# Altium project BMSSlaveBoard.PrjPcb
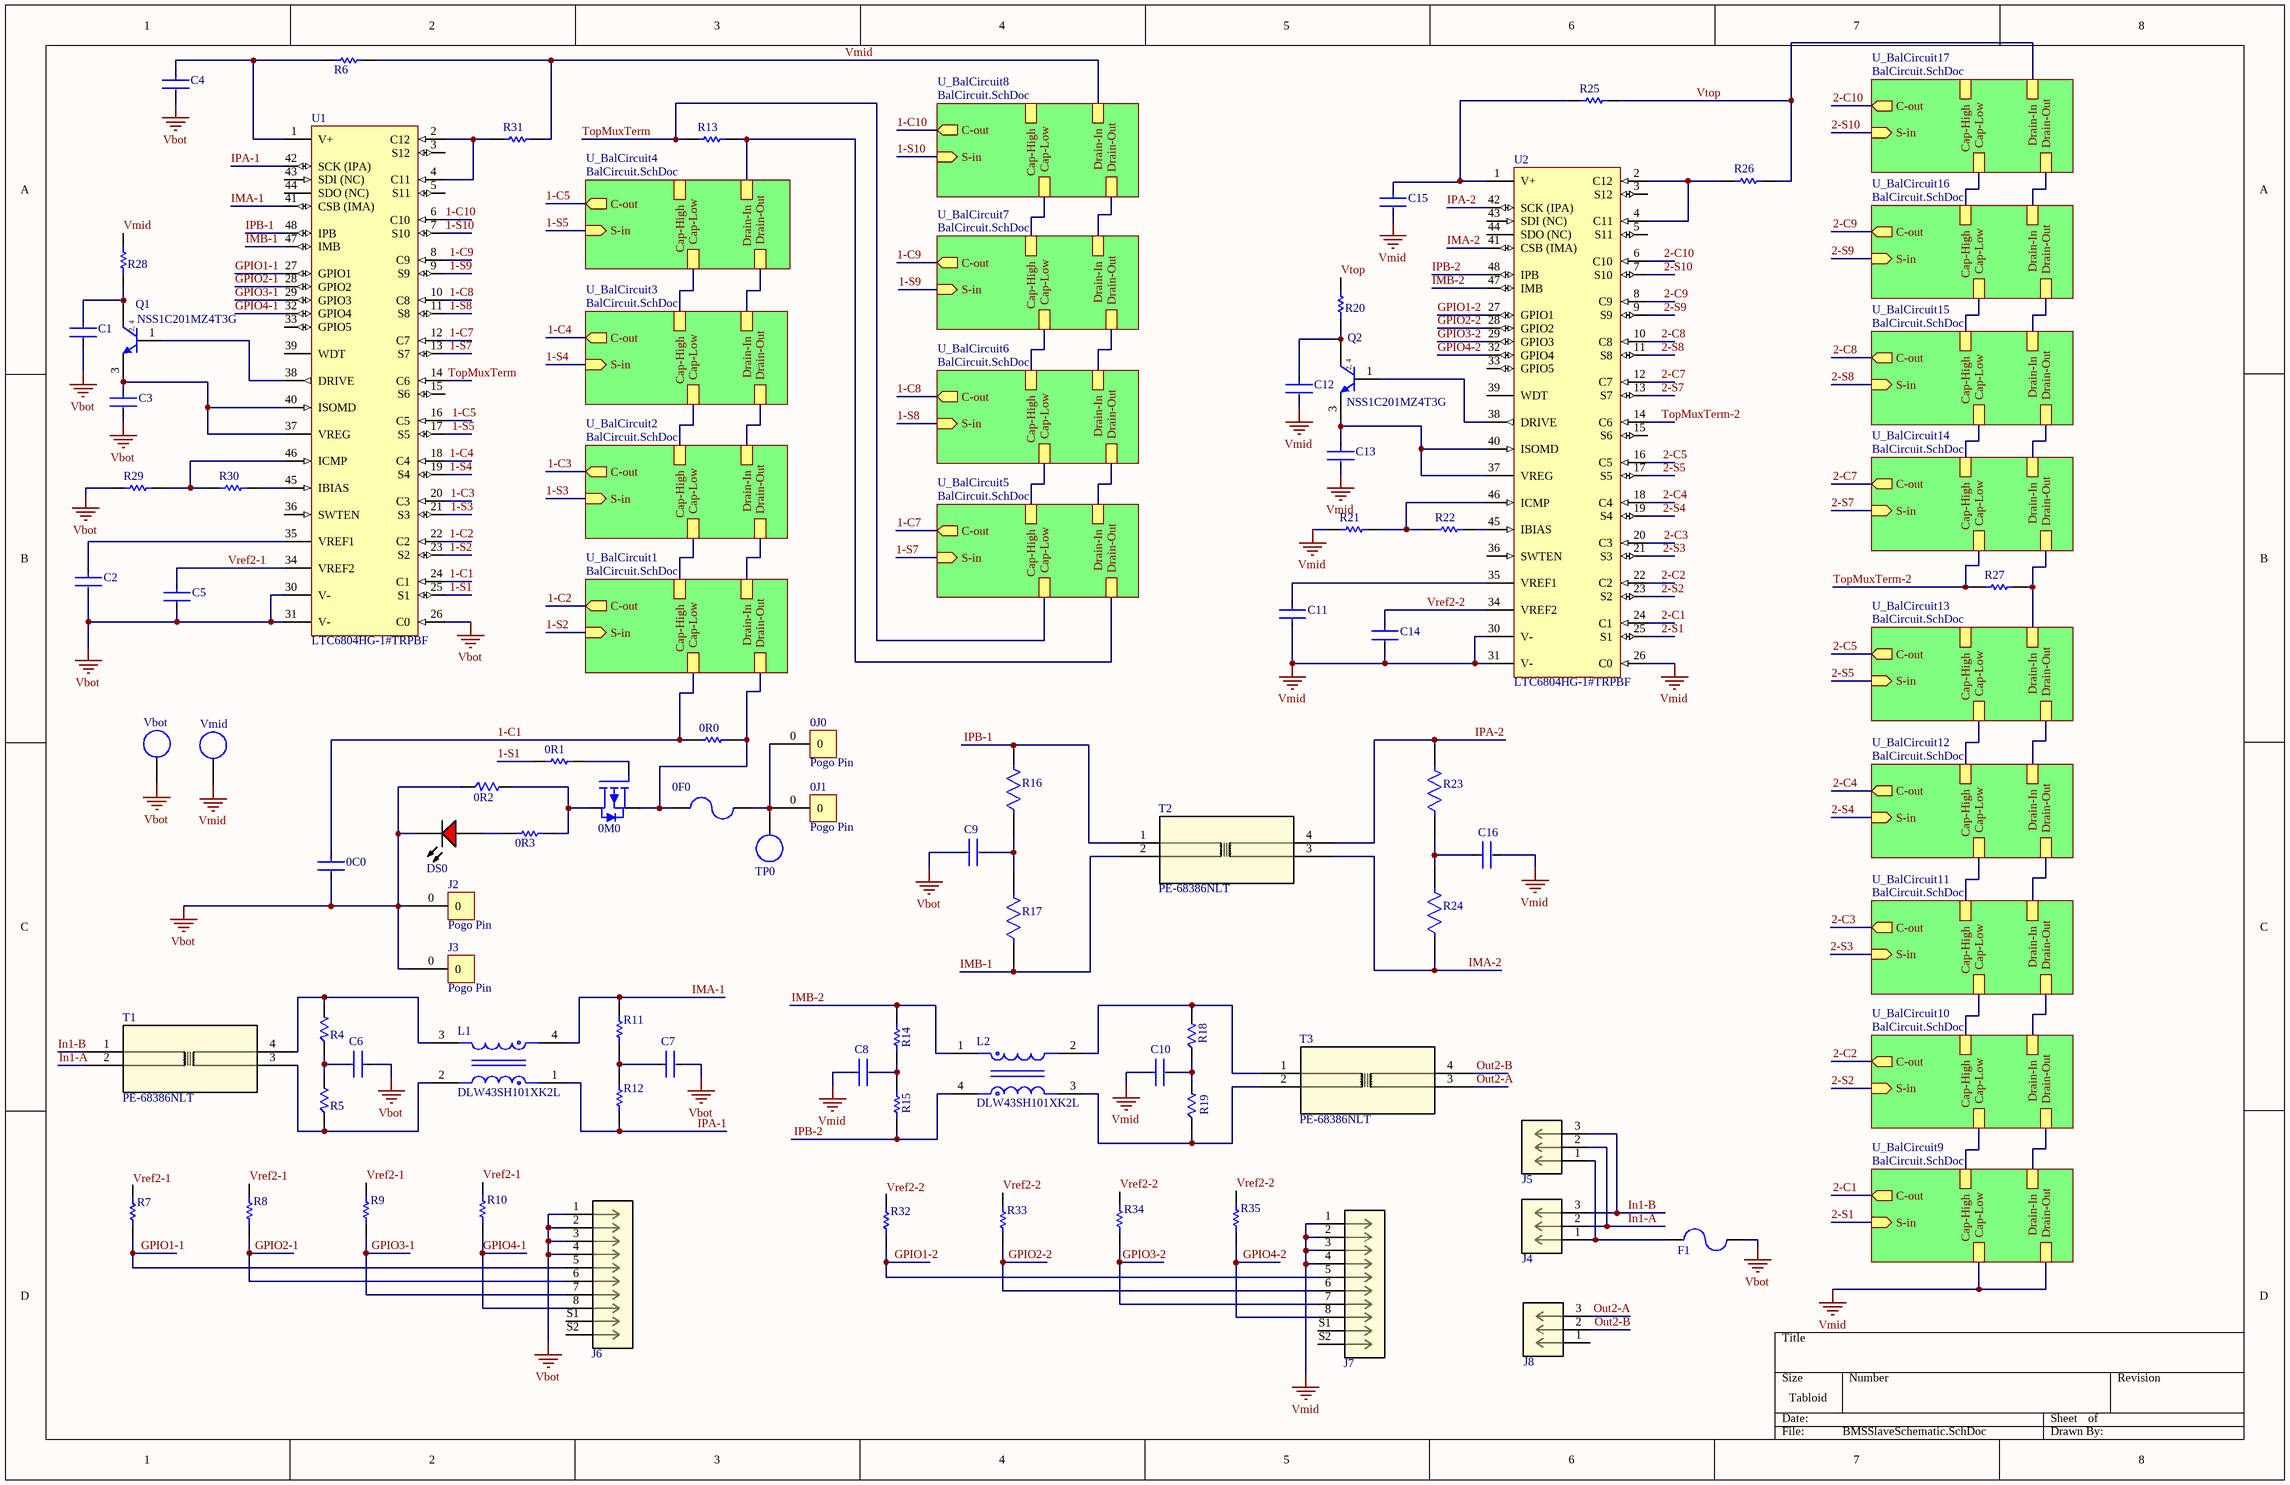
[diagram p0: BMSSlaveSchematic.SchDoc]
2 sheets, 265 parts. Net scope: hierarchical (ports join the sheet entries above them; power ports are global).
Board file: bmsSlavePCB.PcbDoc
Sheets:
  BMSSlaveSchematic.SchDoc
    U_BalCircuit1 = BalCircuit.SchDoc
    U_BalCircuit2 = BalCircuit.SchDoc
    U_BalCircuit3 = BalCircuit.SchDoc
    U_BalCircuit5 = BalCircuit.SchDoc
    U_BalCircuit6 = BalCircuit.SchDoc
    U_BalCircuit7 = BalCircuit.SchDoc
    U_BalCircuit8 = BalCircuit.SchDoc
    U_BalCircuit9 = BalCircuit.SchDoc
    U_BalCircuit10 = BalCircuit.SchDoc
    U_BalCircuit11 = BalCircuit.SchDoc
    U_BalCircuit12 = BalCircuit.SchDoc
    U_BalCircuit13 = BalCircuit.SchDoc
    U_BalCircuit14 = BalCircuit.SchDoc
    U_BalCircuit15 = BalCircuit.SchDoc
    U_BalCircuit16 = BalCircuit.SchDoc
    U_BalCircuit17 = BalCircuit.SchDoc
    U_BalCircuit4 = BalCircuit.SchDoc

## Sheet BMSSlaveSchematic.SchDoc
size Tabloid; Author: P. Kelly; CompanyName: RIT Formula Racing; DrawnBy: P. Kelly; Engineer: P. Kelly; Organization: RIT Formula Racing; Revision: 2; SheetNumber: 1; SheetTotal: 1; DrainRes: 17R 1W

### Parts
0C0  CL21B103KCANNNC  [FP-CL21-IPC_A]  (value not drawn)
0F0  3404.0112.11  [OMT125]  (value not drawn)
0J0  Pogo Pin  [0852-0]
0J1  Pogo Pin  [0852-0]
0M0  SI2301CDS-T1-E3  [SOT23_527AG_ONS]  (value not drawn)
0R0  RK73B2ATTD101J  [RESC2013X60X30NL20T20]  (value not drawn)
0R1  RC0805JR-073K3L  [RESC0805(2012)_M]  (value not drawn)
0R2  352116RFT  [FP-ERJ1TR-IPC_A]  (value not drawn)
0R3  0603WAF750JT5E  [FP-AC0603-0_55-MFG]  (value not drawn)
C1  CL10B104KC8NNNC  [FP-CL10-IPC_A]  (value not drawn)
C2  CC0603KRX7R9BB105  [FP-CC0603-DB-MFG]  (value not drawn)
C3  CC0603KRX7R9BB105  [FP-CC0603-DB-MFG]  (value not drawn)
C4  CL10B104KC8NNNC  [FP-CL10-IPC_A]  (value not drawn)
C5  CC0603KRX7R9BB105  [FP-CC0603-DB-MFG]  (value not drawn)
C6  CL21B103KCANNNC  [FP-CL21-IPC_A]  (value not drawn)
C7  CL21B103KCANNNC  [FP-CL21-IPC_A]  (value not drawn)
C8  CL21B103KCANNNC  [FP-CL21-IPC_A]  (value not drawn)
C9  CL21B103KCANNNC  [FP-CL21-IPC_A]  (value not drawn)
C10  CL21B103KCANNNC  [FP-CL21-IPC_A]  (value not drawn)
C11  CC0603KRX7R9BB105  [FP-CC0603-DB-MFG]  (value not drawn)
C12  CL10B104KC8NNNC  [FP-CL10-IPC_A]  (value not drawn)
C13  CC0603KRX7R9BB105  [FP-CC0603-DB-MFG]  (value not drawn)
C14  CC0603KRX7R9BB105  [FP-CC0603-DB-MFG]  (value not drawn)
C15  CL10B104KC8NNNC  [FP-CL10-IPC_A]  (value not drawn)
C16  CL21B103KCANNNC  [FP-CL21-IPC_A]  (value not drawn)
DS0  19-217/R6C-AL1M2VY/3T  [EVRL-0603-2_V]  (value not drawn)
F1  3404.0112.11  [OMT125]  (value not drawn)
J2  Pogo Pin  [0852-0]
J3  Pogo Pin  [0852-0]
J4  39302031  [CON_39302031]  (value not drawn)
J5  39302031  [CON_39302031]  (value not drawn)
J6  430450810  [CON_430450810_MOL]  (value not drawn)
J7  430450810  [CON_430450810_MOL]  (value not drawn)
J8  39302031  [CON_39302031]  (value not drawn)
L1  DLW43SH101XK2L  [FP-DLW43-0_2-t2_6-e0_6-MFG]
L2  DLW43SH101XK2L  [FP-DLW43-0_2-t2_6-e0_6-MFG]
Q1  NSS1C201MZ4T3G  [ONSC-SOT-223-4-318E-04_V]
Q2  NSS1C201MZ4T3G  [ONSC-SOT-223-4-318E-04_V]
R4  RC1206FR-07300RL  [FP-RC1206-MFG]  (value not drawn)
R5  RC1206FR-07300RL  [FP-RC1206-MFG]  (value not drawn)
R6  ERJ-14YJ101U  [RESC3225X70X50LL20T20]  (value not drawn)
R7  ERJ-PB3B1002V  [FP-AC0603-0_55-MFG]  (value not drawn)
R8  ERJ-PB3B1002V  [FP-AC0603-0_55-MFG]  (value not drawn)
R9  ERJ-PB3B1002V  [FP-AC0603-0_55-MFG]  (value not drawn)
R10  ERJ-PB3B1002V  [FP-AC0603-0_55-MFG]  (value not drawn)
R11  RC1206FR-0762RL  [RESC1206(3216)_N]  (value not drawn)
R12  RC1206FR-0762RL  [RESC1206(3216)_N]  (value not drawn)
R13  RK73B2ATTD101J  [RESC2013X60X30NL20T20]  (value not drawn)
R14  RC1206FR-0762RL  [RESC1206(3216)_N]  (value not drawn)
R15  RC1206FR-0762RL  [RESC1206(3216)_N]  (value not drawn)
R16  AC1206FR-0749R9L  [FP-AC1206-MFG]  (value not drawn)
R17  AC1206FR-0749R9L  [FP-AC1206-MFG]  (value not drawn)
R18  RC1206FR-07300RL  [FP-RC1206-MFG]  (value not drawn)
R19  RC1206FR-07300RL  [FP-RC1206-MFG]  (value not drawn)
R20  ERJ-14YJ101U  [RESC3225X70X50LL20T20]  (value not drawn)
R21  RC0603FR-071K21L  [RESC1608X55X25LL10T15]  (value not drawn)
R22  RC0603FR-07806RL  [RESC1608X55X25LL10T15]  (value not drawn)
R23  AC1206FR-0749R9L  [FP-AC1206-MFG]  (value not drawn)
R24  AC1206FR-0749R9L  [FP-AC1206-MFG]  (value not drawn)
R25  ERJ-14YJ101U  [RESC3225X70X50LL20T20]  (value not drawn)
R26  RK73B2ATTD101J  [RESC2013X60X30NL20T20]  (value not drawn)
R27  RK73B2ATTD101J  [RESC2013X60X30NL20T20]  (value not drawn)
R28  ERJ-14YJ101U  [RESC3225X70X50LL20T20]  (value not drawn)
R29  RC0603FR-071K21L  [RESC1608X55X25LL10T15]  (value not drawn)
R30  RC0603FR-07806RL  [RESC1608X55X25LL10T15]  (value not drawn)
R31  RK73B2ATTD101J  [RESC2013X60X30NL20T20]  (value not drawn)
R32  ERJ-PB3B1002V  [FP-AC0603-0_55-MFG]  (value not drawn)
R33  ERJ-PB3B1002V  [FP-AC0603-0_55-MFG]  (value not drawn)
R34  ERJ-PB3B1002V  [FP-AC0603-0_55-MFG]  (value not drawn)
R35  ERJ-PB3B1002V  [FP-AC0603-0_55-MFG]  (value not drawn)
T1  PE-68386NLT  [PE-68386NL_PUL]
T2  PE-68386NLT  [PE-68386NL_PUL]
T3  PE-68386NLT  [PE-68386NL_PUL]
TP0  N/A  [PCB Test Point]  (value not drawn)
U1  LTC6804HG-1#TRPBF  [LT-G-48_M]
U2  LTC6804HG-1#TRPBF  [LT-G-48_M]
Vbot  N/A  [PCB Test Point]  (value not drawn)
Vmid  N/A  [PCB Test Point]  (value not drawn)

### Sub-sheets
U_BalCircuit1 = BalCircuit.SchDoc: C-out (out), Cap-High, Drain-In, Cap-Low, Drain-Out, S-in (in)
U_BalCircuit2 = BalCircuit.SchDoc: C-out (out), Cap-High, Drain-In, Cap-Low, Drain-Out, S-in (in)
U_BalCircuit3 = BalCircuit.SchDoc: C-out (out), Cap-High, Drain-In, Cap-Low, Drain-Out, S-in (in)
U_BalCircuit4 = BalCircuit.SchDoc: C-out (out), Cap-High, Drain-In, Cap-Low, Drain-Out, S-in (in)
U_BalCircuit5 = BalCircuit.SchDoc: C-out (out), Cap-High, Drain-In, Cap-Low, Drain-Out, S-in (in)
U_BalCircuit6 = BalCircuit.SchDoc: C-out (out), Cap-High, Drain-In, Cap-Low, Drain-Out, S-in (in)
U_BalCircuit7 = BalCircuit.SchDoc: C-out (out), Cap-High, Drain-In, Cap-Low, Drain-Out, S-in (in)
U_BalCircuit8 = BalCircuit.SchDoc: C-out (out), Cap-High, Drain-In, Cap-Low, Drain-Out, S-in (in)
U_BalCircuit9 = BalCircuit.SchDoc: C-out (out), Cap-High, Drain-In, Cap-Low, Drain-Out, S-in (in)
U_BalCircuit10 = BalCircuit.SchDoc: C-out (out), Cap-High, Drain-In, Cap-Low, Drain-Out, S-in (in)
U_BalCircuit11 = BalCircuit.SchDoc: C-out (out), Cap-High, Drain-In, Cap-Low, Drain-Out, S-in (in)
U_BalCircuit12 = BalCircuit.SchDoc: C-out (out), Cap-High, Drain-In, Cap-Low, Drain-Out, S-in (in)
U_BalCircuit13 = BalCircuit.SchDoc: C-out (out), Cap-High, Drain-In, Cap-Low, Drain-Out, S-in (in)
U_BalCircuit14 = BalCircuit.SchDoc: C-out (out), Cap-High, Drain-In, Cap-Low, Drain-Out, S-in (in)
U_BalCircuit15 = BalCircuit.SchDoc: C-out (out), Cap-High, Drain-In, Cap-Low, Drain-Out, S-in (in)
U_BalCircuit16 = BalCircuit.SchDoc: C-out (out), Cap-High, Drain-In, Cap-Low, Drain-Out, S-in (in)
U_BalCircuit17 = BalCircuit.SchDoc: C-out (out), Cap-High, Drain-In, Cap-Low, Drain-Out, S-in (in)

### Nets
Vbot: 0C0.2 0R2.1 C1.2 C2.2 C3.2 C4.2 C5.2 C6.2 C7.2 C9.1 DS0.2(K) F1.2 J2.0 J3.0 J6.1 J6.2 J6.3 J6.4 R29.1 U1.26(C0) U1.30(V-) U1.31(V-) Vbot.1
Vmid: C8.1 C10.1 C11.2 C12.2 C13.2 C14.2 C15.2 C16.2 J7.1 J7.2 J7.3 J7.4 R6.1 R21.1 R28.2 R31.2 U2.26(C0) U2.30(V-) U2.31(V-) Vmid.1 ; sheet U_BalCircuit8/Drain-In, sheet U_BalCircuit9/Cap-Low, sheet U_BalCircuit9/Drain-Out
1-C1: 0C0.1 0R0.1 U1.24(C1) ; sheet U_BalCircuit1/Cap-Low
1-C2: U1.22(C2) ; sheet U_BalCircuit1/C-out, sheet U_BalCircuit1/Cap-High, sheet U_BalCircuit2/Cap-Low
1-C3: U1.20(C3) ; sheet U_BalCircuit2/C-out, sheet U_BalCircuit2/Cap-High, sheet U_BalCircuit3/Cap-Low
1-C4: U1.18(C4) ; sheet U_BalCircuit3/C-out, sheet U_BalCircuit3/Cap-High, sheet U_BalCircuit4/Cap-Low
1-C5: U1.16(C5) ; sheet U_BalCircuit4/C-out, sheet U_BalCircuit4/Cap-High
1-C7: U1.12(C7) ; sheet U_BalCircuit5/C-out, sheet U_BalCircuit5/Cap-High, sheet U_BalCircuit6/Cap-Low
1-C8: U1.10(C8) ; sheet U_BalCircuit6/C-out, sheet U_BalCircuit6/Cap-High, sheet U_BalCircuit7/Cap-Low
1-C9: U1.8(C9) ; sheet U_BalCircuit7/C-out, sheet U_BalCircuit7/Cap-High, sheet U_BalCircuit8/Cap-Low
1-C10: U1.6(C10) ; sheet U_BalCircuit8/C-out, sheet U_BalCircuit8/Cap-High
1-S1: 0R1.1 U1.25(S1)
1-S2: U1.23(S2) ; sheet U_BalCircuit1/S-in
1-S3: U1.21(S3) ; sheet U_BalCircuit2/S-in
1-S4: U1.19(S4) ; sheet U_BalCircuit3/S-in
1-S5: U1.17(S5) ; sheet U_BalCircuit4/S-in
1-S7: U1.13(S7) ; sheet U_BalCircuit5/S-in
1-S8: U1.11(S8) ; sheet U_BalCircuit6/S-in
1-S9: U1.9(S9) ; sheet U_BalCircuit7/S-in
1-S10: U1.7(S10) ; sheet U_BalCircuit8/S-in
2-C1: U2.24(C1) ; sheet U_BalCircuit9/C-out, sheet U_BalCircuit9/Cap-High, sheet U_BalCircuit10/Cap-Low
2-C2: U2.22(C2) ; sheet U_BalCircuit10/C-out, sheet U_BalCircuit10/Cap-High, sheet U_BalCircuit11/Cap-Low
2-C3: U2.20(C3) ; sheet U_BalCircuit11/C-out, sheet U_BalCircuit11/Cap-High, sheet U_BalCircuit12/Cap-Low
2-C4: U2.18(C4) ; sheet U_BalCircuit12/C-out, sheet U_BalCircuit12/Cap-High, sheet U_BalCircuit13/Cap-Low
2-C5: U2.16(C5) ; sheet U_BalCircuit13/C-out, sheet U_BalCircuit13/Cap-High
2-C7: U2.12(C7) ; sheet U_BalCircuit14/C-out, sheet U_BalCircuit14/Cap-High, sheet U_BalCircuit15/Cap-Low
2-C8: U2.10(C8) ; sheet U_BalCircuit15/C-out, sheet U_BalCircuit15/Cap-High, sheet U_BalCircuit16/Cap-Low
2-C9: U2.8(C9) ; sheet U_BalCircuit16/C-out, sheet U_BalCircuit16/Cap-High, sheet U_BalCircuit17/Cap-Low
2-C10: U2.6(C10) ; sheet U_BalCircuit17/C-out, sheet U_BalCircuit17/Cap-High
2-S1: U2.25(S1) ; sheet U_BalCircuit9/S-in
2-S2: U2.23(S2) ; sheet U_BalCircuit10/S-in
2-S3: U2.21(S3) ; sheet U_BalCircuit11/S-in
2-S4: U2.19(S4) ; sheet U_BalCircuit12/S-in
2-S5: U2.17(S5) ; sheet U_BalCircuit13/S-in
2-S7: U2.13(S7) ; sheet U_BalCircuit14/S-in
2-S8: U2.11(S8) ; sheet U_BalCircuit15/S-in
2-S9: U2.9(S9) ; sheet U_BalCircuit16/S-in
2-S10: U2.7(S10) ; sheet U_BalCircuit17/S-in
GPIO1-1: J6.5 R7.2 U1.27(GPIO1)
GPIO1-2: J7.5 R32.2 U2.27(GPIO1)
GPIO2-1: J6.6 R8.2 U1.28(GPIO2)
GPIO2-2: J7.6 R33.2 U2.28(GPIO2)
GPIO3-1: J6.7 R9.2 U1.29(GPIO3)
GPIO3-2: J7.7 R34.2 U2.29(GPIO3)
GPIO4-1: J6.8 R10.2 U1.32(GPIO4)
GPIO4-2: J7.8 R35.2 U2.32(GPIO4)
IMA-1: L1.4 R11.2 U1.41(CSB_(IMA))
IMA-2: R24.1 T2.3 U2.41(CSB_(IMA))
IMB-1: R17.1 T2.2 U1.47(IMB)
IMB-2: L2.1 R14.2 U2.47(IMB)
In1-A: J4.2 J5.2 T1.2
In1-B: J4.3 J5.3 T1.1
IPA-1: L1.1 R12.1 U1.42(SCK_(IPA))
IPA-2: R23.2 T2.4 U2.42(SCK_(IPA))
IPB-1: R16.2 T2.1 U1.48(IPB)
IPB-2: L2.4 R15.1 U2.48(IPB)
Out2-A: J8.3 T3.3
Out2-B: J8.2 T3.4
TopMuxTerm: R13.1 U1.14(C6) ; sheet U_BalCircuit5/Cap-Low
TopMuxTerm-2: R27.1 U2.14(C6) ; sheet U_BalCircuit14/Cap-Low
Vref2-1: C5.1 R7.1 R8.1 R9.1 R10.1 U1.34(VREF2)
Vref2-2: C14.1 R32.1 R33.1 R34.1 R35.1 U2.34(VREF2)
Vtop: R20.2 R25.2 R26.2 ; sheet U_BalCircuit17/Drain-In
Net0F0_1: 0F0.1 0M0.2 0R0.2 ; sheet U_BalCircuit1/Drain-Out
Net0F0_2: 0F0.2 0J0.0 0J1.0 TP0.1
Net0M0_1: 0M0.1 0R1.2
Net0M0_3: 0M0.3 0R2.2 0R3.1
Net0R3_2: 0R3.2 DS0.1(A)
NetC1_1: C1.1 Q1.2(C) Q1.4(C) R28.1
NetC2_1: C2.1 U1.35(VREF1)
NetC3_1: C3.1 Q1.3(E) U1.37(VREG) U1.40(ISOMD)
NetC4_1: C4.1 R6.2 U1.1(V+)
NetC6_1: C6.1 R4.1 R5.2
NetC7_1: C7.1 R11.1 R12.2
NetC8_2: C8.2 R14.1 R15.2
NetC9_2: C9.2 R16.1 R17.2
NetC10_2: C10.2 R18.1 R19.2
NetC11_1: C11.1 U2.35(VREF1)
NetC12_1: C12.1 Q2.2(C) Q2.4(C) R20.1
NetC13_1: C13.1 Q2.3(E) U2.37(VREG) U2.40(ISOMD)
NetC15_1: C15.1 R25.1 U2.1(V+)
NetC16_1: C16.1 R23.1 R24.2
NetDS0_3_2: sheet U_BalCircuit1/Drain-In, sheet U_BalCircuit2/Drain-Out
NetDS0_4_2: sheet U_BalCircuit2/Drain-In, sheet U_BalCircuit3/Drain-Out
NetDS0_5_2: sheet U_BalCircuit3/Drain-In, sheet U_BalCircuit4/Drain-Out
NetDS0_6_2: R13.2 ; sheet U_BalCircuit5/Drain-Out, sheet U_BalCircuit4/Drain-In
NetDS0_7_2: sheet U_BalCircuit5/Drain-In, sheet U_BalCircuit6/Drain-Out
NetDS0_8_2: sheet U_BalCircuit6/Drain-In, sheet U_BalCircuit7/Drain-Out
NetDS0_9_2: sheet U_BalCircuit7/Drain-In, sheet U_BalCircuit8/Drain-Out
NetDS0_11_2: sheet U_BalCircuit9/Drain-In, sheet U_BalCircuit10/Drain-Out
NetDS0_12_2: sheet U_BalCircuit10/Drain-In, sheet U_BalCircuit11/Drain-Out
NetDS0_13_2: sheet U_BalCircuit11/Drain-In, sheet U_BalCircuit12/Drain-Out
NetDS0_14_2: sheet U_BalCircuit12/Drain-In, sheet U_BalCircuit13/Drain-Out
NetDS0_15_2: R27.2 ; sheet U_BalCircuit13/Drain-In, sheet U_BalCircuit14/Drain-Out
NetDS0_16_2: sheet U_BalCircuit14/Drain-In, sheet U_BalCircuit15/Drain-Out
NetDS0_17_2: sheet U_BalCircuit15/Drain-In, sheet U_BalCircuit16/Drain-Out
NetDS0_18_2: sheet U_BalCircuit16/Drain-In, sheet U_BalCircuit17/Drain-Out
NetF1_1: F1.1 J4.1 J5.1
NetL1_2: L1.2 R5.1 T1.3
NetL1_3: L1.3 R4.2 T1.4
NetL2_2: L2.2 R18.2 T3.1
NetL2_3: L2.3 R19.1 T3.2
NetQ1_1: Q1.1(B) U1.38(DRIVE)
NetQ2_1: Q2.1(B) U2.38(DRIVE)
NetR21_2: R21.2 R22.1 U2.46(ICMP)
NetR22_2: R22.2 U2.45(IBIAS)
NetR26_1: R26.1 U2.2(C12) U2.4(C11)
NetR29_2: R29.2 R30.1 U1.46(ICMP)
NetR30_2: R30.2 U1.45(IBIAS)
NetR31_1: R31.1 U1.2(C12) U1.4(C11)

Not connected (* = marked no-connect by the designer): J6 S1 S2; J7 S1 S2; J8 1; U1 3(S12) 5(S11) 15(S6) 33(GPIO5) 36(SWTEN) 39(WDT) 43(SDI_(NC)) 44(SDO_(NC)); U2 3(S12) 5(S11) 15(S6) 33(GPIO5) 36(SWTEN) 39(WDT) 43(SDI_(NC)) 44(SDO_(NC))

### Notes on the sheet
- (in symbol CMP-1048-00451-1) 2, 4

### Library data of the parts
0C0 C6-C10 C16 = CMP-13271-003077-1: CL21 Series 0805 10nF 100V ±10% Tolerance X7R Multilayer Ceramic Chip Capacitor; Voltage: 100V; Contact Plating: Tin; Height: 0.65mm; Thickness: 0.03inch; Min Operating Temperature: -55°C; Capacitance: 10nF; Length: 2mm; Max Operating Temperature: 125°C; Case Code (Imperial): 0805; Radiation Hardening: No; Dielectric: X7R; Material: Ceramic; Depth: 1.25mm; Voltage Rating: 100V; Case/Package: 0805; Tolerance: 10%; Package Quantity: 1; Width: 0.049inch; Mount: Surface Mount; Case Code (Metric): 2012; Packaging: Tape and Reel
  C6: Part No.: CL21B103KCANNNC
0F0 F1 = OMT125: SCHURTER   3404.0112.11   FUSE, 1/2A, 125VDC, SMT; Manufacturer Part Number 1: 3404.0114.11; Body Material: Thermoplastic; Current Rating: 1A; Voltage Rating: 125V; Power Dissipation: 88mW; Fuse Type: Board Mount (Cartridge Style Excluded); Fuse Size: 7.4 X 3.1mm; Blow Characteristic: TIME DELAY; Approvals: cURus,cULus,UL; Supplier 1: Digi-Key; Manufacturer 1: Schurter; RoHS: Yes; Category: Fuses; Stock 1: 1439; Pricing 1: 1=0.67000, 50=0.56400, 100=0.43100, 500=0.42300, 1000=0.38171 (USD); Mount: Surface Mount,PCB; Case/Package: SMD/SMT; Number of Pins: 2; Contact Material: Copper Alloy; Contact Plating: Tin; Housing Material: Thermoplastic; Terminal Material: Tin; Min Operating Temperature: -55°C; Max Operating Temperature: 85°C; Package Quantity: 100; Voltage Rating (AC): 125V; Voltage Rating (DC): 125V; Packaging: Bag; Max Voltage Rating (DC): 125V; Max Voltage Rating (AC): 125V; Current: 1A; Termination: SMD/SMT; Fuse Current: 1A; Series: OMT 125; Length: 7.4mm; Width: 0.122inch; Height: 0.102inch; Depth: 3.1mm; Radiation Hardening: No; REACH SVHC: No SVHC; Flammability Rating: UL94 V-0; RoHS Compliant: Yes; ComponentLink1URL: https://datasheet.ciiva.com/4486/typ-omt-125-14932-4486467.pdf?src-supplier=Mouser; ComponentLink1Description: https://datasheet.ciiva.com/4486/typ-omt-125-14932-4486467.pdf?src-supplier=Mouser; ComponentLink2URL: https://datasheet.ciiva.com/26876/getdatasheetpartid-627585-26876503.pdf?src-supplier=Verical; ComponentLink2Description: https://datasheet.ciiva.com/26876/getdatasheetpartid-627585-26876503.pdf?src-supplier=Verical; ComponentLink3URL: https://datasheet.ciiva.com/17402/typ-omt-125-17402981.pdf?src-supplier=Avnet+Europe; ComponentLink3Description: https://datasheet.ciiva.com/17402/typ-omt-125-17402981.pdf?src-supplier=Avnet+Europe; ComponentLink4URL: https://datasheet.ciiva.com/1549/typ-omt-125-1549883.pdf?src-supplier=Element14; ComponentLink4Description: https://datasheet.ciiva.com/1549/typ-omt-125-1549883.pdf?src-supplier=Element14; ComponentLink5URL: https://datasheet.ciiva.com/8264/typ-omt-125-8264396.pdf?src-supplier=Avnet; ComponentLink5Description: https://datasheet.ciiva.com/8264/typ-omt-125-8264396.pdf?src-supplier=Avnet
0J0 0J1 J2 J3 = 0852-0-15-20-83-14-11-0: 90 thou stroke
0M0 = SI2301CDS-T1-E3: Trans Mosfet P-ch 20V 3.1A 3-PIN SOT-23 T/r / Mosfet P-ch 20V 3.1A SOT23-3; Manufacturer 1: Vishay Siliconix; Rds On Max: 112mR; Input Capacitance: 405pF; Rise Time: 35ns; Max Power Dissipation: 1.6W; Gate to Source Voltage (Vgs): 8V; Turn-Off Delay Time: 30ns; Threshold Voltage: -400mV; Turn-On Delay Time: 11ns; Element Configuration: Single; Drain to Source Breakdown Voltage: -20V; Number of Channels: 1; Polarity: P-CHANNEL; Supplier 1: Digi-Key; Manufacturer Part Number 1: SI2301CDS-T1-E3; RoHS: Yes; Category: MOSFETs; Stock 1: 82098; Pricing 1: 1=0.51000, 10=0.38800, 100=0.24160, 500=0.16530, 1000=0.12716 (USD); Mount: Surface Mount; Case/Package: SOT-23-3; Number of Pins: 3; Weight: 0.050717oz; Min Operating Temperature: -55°C; Max Operating Temperature: 150°C; Package Quantity: 1; Packaging: Tape and Reel; Drain to Source Voltage (Vdss): 20V; Continuous Drain Current (ID): 3.1A; Drain to Source Resistance: 112mR; Fall Time: 35ns; Series: TrenchFET®; Length: 3.04mm; Width: 1.4mm; Height: 1.02mm; Radiation Hardening: No; REACH SVHC: Unknown; Lead Free: Lead Free; RoHS Compliant: Yes; ComponentLink1URL: https://datasheet.ciiva.com/4442/si2301cd-244544-4442236.pdf?src-supplier=Mouser; ComponentLink1Description: https://datasheet.ciiva.com/4442/si2301cd-244544-4442236.pdf?src-supplier=Mouser; ComponentLink2URL: https://datasheet.ciiva.com/22652/1719653-22652314.pdf?src-supplier=Element14; ComponentLink2Description: https://datasheet.ciiva.com/22652/1719653-22652314.pdf?src-supplier=Element14; ComponentLink3URL: https://datasheet.ciiva.com/2957/si2301cd-2957335.pdf?src-supplier=Digi-Key; ComponentLink3Description: https://datasheet.ciiva.com/2957/si2301cd-2957335.pdf?src-supplier=Digi-Key; ComponentLink4URL: https://datasheet.ciiva.com/2957/si2301cd-2957336.pdf?src-supplier=Digi-Key; ComponentLink4Description: https://datasheet.ciiva.com/2957/si2301cd-2957336.pdf?src-supplier=Digi-Key; ComponentLink5URL: https://datasheet.ciiva.com/11160/si2301cd-11160982.pdf?src-supplier=Avnet; ComponentLink5Description: https://datasheet.ciiva.com/11160/si2301cd-11160982.pdf?src-supplier=Avnet; ComponentLink6URL: https://datasheet.ciiva.com/26137/si2301cd-26137818.pdf?src-supplier=Avnet+Europe; ComponentLink6Description: https://datasheet.ciiva.com/26137/si2301cd-26137818.pdf?src-supplier=Avnet+Europe
0R0 R13 R26 R27 R31 = CMP-2001-04655-1: 100R 1/4W 5% 0805; Manufacturer: KOA Speer; Part Number: RK73B2ATTD101J
0R1 = CMP-1013-00086-1: 3K3 0.125W 5% 0805 (2012 Metric)  SMD; Case-Metric: 2012; Case-EIA: 0805; Value: 3300.00 Ohm; Tolerance: 5 %; Technology: SMT; Power: 0.125 W
0R2 = 352116RFT: Res Thick Film 2512 16 Ohm 1% 2W ±100ppm/C Pad SMD Automotive T/R; Manufacturer 1: TE Connectivity; Resistance: 16R; Temperature Coefficient: 100ppm/°C; Voltage Rating: 250V; Number of Resistors: 1; Supplier 1: Digi-Key; Manufacturer Part Number 1: 352116RFT; RoHS: Yes; Category: Chip SMD Resistors; Stock 1: 79023; Pricing 1: 1=0.83000, 10=0.61200, 100=0.35610, 1000=0.19972 (USD); Mount: Surface Mount; Case/Package: 2512; Case Code (Metric): 6432; Case Code (Imperial): 2512; Min Operating Temperature: -55°C; Max Operating Temperature: 155°C; Tolerance: 1%; Packaging: Tape and Reel; Resistor Type: Thick Film,Power resistor; Number of Terminations: 2; Power Rating: 2W; Termination: Solder; Voltage Rating (DC): 250V; Technology: THICK FILM; Series: 3521; Resistance Tolerance: 1%; Length: 6.3mm; Height: 0.55mm; Depth: 3.2mm; RoHS Compliant: Yes; REACH SVHC: No SVHC; ELV: Compliant; ComponentLink1URL: https://datasheet.ciiva.com/25610/0900766b81096b90-25610624.pdf?src-supplier=RSComponents; ComponentLink1Description: https://datasheet.ciiva.com/25610/0900766b81096b90-25610624.pdf?src-supplier=RSComponents; ComponentLink2URL: https://datasheet.ciiva.com/46391/1610601-46391497.pdf?src-supplier=Element14; ComponentLink2Description: https://datasheet.ciiva.com/46391/1610601-46391497.pdf?src-supplier=Element14; ComponentLink3URL: https://datasheet.ciiva.com/7657/1610601-7657546.pdf?src-supplier=Element14; ComponentLink3Description: https://datasheet.ciiva.com/7657/1610601-7657546.pdf?src-supplier=Element14; Supplier Part Number 1: A115989CT-ND
0R3 = 0603WAF750JT5E: ±1% ±200ppm/℃ 75Ω 0.1W 0603 Chip Resistor - Surface Mount ROHS; Manufacturer 1: Panasonic; Manufacturer Part Number 1: ERJ-PB3B1002V; Resistance: 10kR; Tolerance: 0.1%; Max Power Dissipation: 200mW; Temperature Coefficient: 50ppm/°C; RoHS: Yes; Category: Chip SMD Resistors; Stock 1: 3; Pricing 1: 1=0.23000, 10=0.19100, 25=0.13920, 50=0.10100, 100=0.07480, 250=0.05744, 500=0.04524, 1000=0.03132 (USD); Case/Package: 0603; Case Code (Metric): 1608; Case Code (Imperial): 0603; Min Operating Temperature: -55°C; Max Operating Temperature: 155°C; Packaging: Tape and Reel; Resistor Type: Thick Film; Number of Terminations: 2; Features: Automotive AEC-Q200; Length: 0.063inch; Width: 0.032inch; Height - Seated (Max): 0.022inch; ComponentLink1URL: https://industrial.panasonic.com/sa/system/files/data/download/catalog/id_fixed-resistors_e_2.pdf?src-supplier=Digi-Key; ComponentLink1Description: https://industrial.panasonic.com/sa/system/files/data/download/catalog/id_fixed-resistors_e_2.pdf?src-supplier=Digi-Key; ComponentLink2URL: https://industrial.panasonic.com/cdbs/www-data/pdf/RDM0000/DMM0000COL5.pdf?src-supplier=Digi-Key; ComponentLink2Description: https://industrial.panasonic.com/cdbs/www-data/pdf/RDM0000/DMM0000COL5.pdf?src-supplier=Digi-Key
C1 C4 C12 C15 = CMP-13271-004036-1: Cap Ceramic 100nF 100V X7R ±10% Pad SMD 0603 +125°C T/R; Mount: Surface Mount; Packaging: Cut Tape; Width: 0.031inch; Thickness: 0.035inch; Length: 0.063inch; Tolerance: 10%; Min Operating Temperature: -55°C; Case/Package: 0603; Voltage Rating: 100V; Max Operating Temperature: 125°C; Case Code (Metric): 1608; Capacitance: 100nF; Case Code (Imperial): 0603
C2 C3 C5 C11 C13 C14 = CMP-03422-000761-2: CAP CER 1UF 50V X7R 0603; Tolerance: 10%; Lead Free: Lead Free; Max Operating Temperature: 125°C; Width: 0.031inch; Voltage Rating: 50V; Mount: Surface Mount; Resistor Type: Ceramic; Halogen Free: Halogen Free; Weight: 7.1E-05oz; Voltage Rating (DC): 50V; Package Quantity: 4000; Termination: SMD/SMT; Length: 0.063inch; Min Operating Temperature: -55°C; Dielectric: X7R; Case Code (Metric): 1608; Case Code (Imperial): 0603; Packaging: Tape and Reel; Thickness: 0.035inch; Capacitance: 1uF; Case/Package: 0603
DS0 = CMP-2100-03578-1: Chip LED, Red, 5 V, 25 mA, -40 to 85 degC, 2-Pin SMD (0603), RoHS, Tape and Reel; Manufacturer: Everlight Electronics; Forward Voltage: 2.2V; Lens Style: Clear; Package Reference: 0603; Case/Package: 0603; RoHSCompliant: false; Package Description: 2-Pin Surface Mount Device, Body 1.6 x 0.8 mm; Colour: Red; Lead Free: LeadFree; Datasheet URL: https://datasheet.ciiva.com/4688/el-19-217-r6c-al1m2vy-3tpdf-187026-4688713.pdf; Manufacturer URL: http://www.everlight.com/; Datasheet Version: Rev. 1, 01/2005
J4 J5 J8 = 39302031: No Description Available; Mfr_Name: Molex Connector Corporation; Copyright: Copyright (C) 2021 Ultra Librarian. All rights reserved.; Manufacturer_Part_Number: 39302031; RefDes: RefDes; Type: DEV
J6 J7 = 430450810: Molex micro-fit 8 pin dual row smd; Mfr_Name: Molex Connector Corporation; Copyright: Copyright (C) 2021 Ultra Librarian. All rights reserved.; Manufacturer_Part_Number: 430450810; RefDes: RefDes; Type: DEV
L1 L2 = CMP-06045-000059-1: CMC 100UH 200MA 2LN SMD AEC-Q200; Shielding: Unshielded; Tolerance: 50%; DC Resistance (DCR): 2R; Voltage Rating: 50V; Test Frequency: 1MHz; Number of Lines: 2; Weight: 0.005997oz; Packaging: Tape and Reel; REACH SVHC: No SVHC; Termination: SMD/SMT; Min Operating Temperature: -40°C; Max DC Current: 200mA; Military Standard: Not; Case/Package: 1812; DC Current: 200mA; Mount: Surface Mount; Length: 4.5mm; Case Code (Metric): 4532; Max Operating Temperature: 125°C; Package Quantity: 1; Height: 2.6mm; Width: 0.126inch; Depth: 3.4mm; Radiation Hardening: No; Current Rating: 200mA; Inductance: 100uH; Lead Free: Lead Free; Case Code (Imperial): 1812; Current: 200mA
Q1 Q2 = CMP-1048-00451-1: 100 V, 2 A, Low VCE(sat), NPN Transistor, 4-Pin SOT-223, Pb-Free, Tape and Reel; Manufacturer: On Semiconductor; IC Continuous (A): 2; RoHS: TRUE; ComponentLink2URL: http://www.onsemi.cn/pub_link/Collateral/NSS1C201MZ4-D.PDF; ComponentLink2Description: Datasheet; PackageDescription: 4-Pin Small Outline Transistor, Body 6.5 x 3.5 mm, Pitch 2.3 mm; Packing: Tape and Reel; PackageVersion: Rev. N, 08/2009; ComponentLink1Description: Manufacturer URL; Mounting Technology: Surface Mount; ComponentLink1URL: http://www.onsemi.com/; ComponentLink3Description: Package Specification; Polarity: NPN; ComponentLink3URL: http://www.onsemi.com/pub_link/Collateral/318E-04.PDF; DatasheetVersion: Rev. 4; PartNumber: NSS1C201MZ4T3G; PackageReference: SOT-223-4-318E-04
R4 R5 R18 R19 = RC1206FR-07300RL: Res Thick Film 1206 300 Ohm 1% 1/4W +/-100ppm/ßC Molded SMD Paper T/R; Manufacturer 1: Yageo; Resistance: 300R; Power Rating: 250mW; Voltage Rating: 200V; Temperature Coefficient: 100ppm/°C; Supplier 1: Digi-Key; Manufacturer Part Number 1: RC1206FR-07300RL; RoHS: Yes; Category: Chip SMD Resistors; Stock 1: 22; Pricing 1: 1=0.10000, 10=0.07400, 100=0.03010, 1000=0.01353, 2500=0.01174 (USD); Mount: Surface Mount; Case/Package: 1206; Case Code (Metric): 3216; Case Code (Imperial): 1206; Size Code: 1206; Min Operating Temperature: -55°C; Max Operating Temperature: 155°C; Package Quantity: 1; Tolerance: 1%; Packaging: Tape and Reel; Resistor Type: Thick Film; Number of Terminations: 2; Termination: SMD/SMT; Max Power Dissipation: 250mW; Voltage Rating (DC): 200V; Features: Moisture Resistant; Series: RC; Construction: Rectangular; Length: 0.122inch; Width: 0.063inch; Height: 0.026inch; Depth: 1.6mm; Military Standard: Not; Lead Free: Lead Free; RoHS Compliant: Yes; ComponentLink1URL: https://datasheet.ciiva.com/2461/pyu-rc1206-51-rohs-l-4-2461311.pdf?src-supplier=Digi-Key; ComponentLink1Description: https://datasheet.ciiva.com/2461/pyu-rc1206-51-rohs-l-4-2461311.pdf?src-supplier=Digi-Key; ComponentLink2URL: https://datasheet.ciiva.com/2461/pyu-rc1206-51-rohs-l-4-2461312.pdf?src-supplier=Digi-Key; ComponentLink2Description: https://datasheet.ciiva.com/2461/pyu-rc1206-51-rohs-l-4-2461312.pdf?src-supplier=Digi-Key; ComponentLink3URL: https://datasheet.ciiva.com/2461/pyu-rc1206-51-rohs-l-4-2461313.pdf?src-supplier=Digi-Key; ComponentLink3Description: https://datasheet.ciiva.com/2461/pyu-rc1206-51-rohs-l-4-2461313.pdf?src-supplier=Digi-Key; ComponentLink4URL: https://datasheet.ciiva.com/17471/pyu-rc1206-51-rohs-l-4-17471032.pdf?src-supplier=Future+Electronics; ComponentLink4Description: https://datasheet.ciiva.com/17471/pyu-rc1206-51-rohs-l-4-17471032.pdf?src-supplier=Future+Electronics; Supplier Part Number 1: 311-300FRCT-ND
R6 R20 R25 R28 = CMP-2005-03479-1: 100R 1/2W 5% 1210; Manufacturer: Panasonic; Part Number: ERJ-14YJ101U
R7-R10 R32-R35 = ERJ-PB3B1002V: Res Thick Film 0603 10K Ohm 0.1% 0.2W(1/5W) ±50ppm/°C Pad SMD Automotive T/R; Manufacturer 1: Panasonic; Resistance: 10kR; Max Power Dissipation: 200mW; Supplier 1: Digi-Key; Manufacturer Part Number 1: ERJ-PB3B1002V; RoHS: Yes; Category: Chip SMD Resistors; Stock 1: 3; Pricing 1: 1=0.23000, 10=0.19100, 25=0.13920, 50=0.10100, 100=0.07480, 250=0.05744, 500=0.04524, 1000=0.03132 (USD); Case/Package: 0603; Case Code (Metric): 1608; Case Code (Imperial): 0603; Min Operating Temperature: -55°C; Max Operating Temperature: 155°C; Packaging: Tape and Reel; Resistor Type: Thick Film; Number of Terminations: 2; Tolerance: 0.1%; Temperature Coefficient: 50ppm/°C; Features: Automotive AEC-Q200; Length: 0.063inch; Width: 0.032inch; Height - Seated (Max): 0.022inch; ComponentLink1URL: https://industrial.panasonic.com/sa/system/files/data/download/catalog/id_fixed-resistors_e_2.pdf?src-supplier=Digi-Key; ComponentLink1Description: https://industrial.panasonic.com/sa/system/files/data/download/catalog/id_fixed-resistors_e_2.pdf?src-supplier=Digi-Key; ComponentLink2URL: https://industrial.panasonic.com/cdbs/www-data/pdf/RDM0000/DMM0000COL5.pdf?src-supplier=Digi-Key; ComponentLink2Description: https://industrial.panasonic.com/cdbs/www-data/pdf/RDM0000/DMM0000COL5.pdf?src-supplier=Digi-Key; Supplier Part Number 1: P20086CT-ND
R11 R12 R14 R15 = CMP-1014-00373-1: 62R 0.25W 1% 1206 (3216 Metric)  SMD; Case-Metric: 3216; Value: 62.00 Ohm; Case-EIA: 1206; Power: 0.25 W; Technology: SMT; Tolerance: 1 %
R16 R17 R23 R24 = CMP-03412-027409-1: RES SMD 49.9 OHM 1% 1/4W 1206; Manufacturer: Yageo; Voltage Rating: 200V; Power Rating: 0.25W; Automotive Grade: Grade 0; Value: 49.9Ω; Tolerance: 0.01; Package: AC1206; Composition: Thick Film; Lead Free: Yes; RoHS: TRUE; Temperature Range Low: -55°C; Footprint Url: http://www.yageo.com/exep/pages/download/literatures/PYu-R_Mount_10.pdf; ComponentLink2Description: Datasheet; Digikey Description: RES SMD 49.9 OHM 1% 1/4W 1206; Height: 0.65mm; Temperature Range High: +155°C; ComponentLink2URL: http://www.yageo.com/NewPortal/yageodocoutput?fileName=/pdf/R-Chip/PYu-AC_51_RoHS_L_6.pdf; Automotive: Yes; Temperature: -55°C to +155°C; Device Class L1: Passive Components; Device Class L2: Resistors; Octopart: https://octopart.com/ac1206fr-0749r9l-yageo-25508608; Series: AC; Device Class L3: Chip SMD Resistors; Resistance: 49.9Ω; Category: Res; Manufacturer Part Number: AC1206FR-0749R9L; Ipc Land Pattern Name: RESC310160X55; Mouser Description: Thick Film Resistors 1/4W 49.9ohm 1% AEC-Q200
R21 R29 = CMP-2000-03933-1: Manufacturer: Yageo; Part Number: RC0603FR-071K21L
R22 R30 = CMP-2000-04142-1: Manufacturer: Yageo; Part Number: RC0603FR-07806RL
T1-T3 = PE-68386NLT: No Description Available; Vendor: Pulse Electronics Corporation; Built_By: EMA_Cory; SourceLibrary: Pulse_Electronics_2019-12-18; Type: DEV; Manufacturer_Part_Number: PE-68386NLT; Copyright: Copyright (C) 2018 Accelerated Designs. All rights reserved; RefDes: RefDes
TP0 Vbot Vmid = PCB Test Point: Manufacturer: RIT Racing; TargetLibrary: RITRacing-Connectors; PartNumber: N/A; Publisher: T.Tallo; Published: 22Oct2016; Status: Active; ComponentLink1URL: http://www.mouser.com/ds/2/215/005-5009-743680.pdf; ComponentLink1Description: Datasheet
U1 U2 = CMP-0471-00242-1: Multicell Battery Monitor, 60 V Vin MAX, 48-pin SOP (G-48), -40 to 125 degC, Pb-Free, Tape and Reel; Manufacturer: Linear Technology; Number of Cells: > 1000 V of stacked Li-Ion cells; Battery Chemistry: Li-Ion, Li-Polymer, NiMH; Vin Max(V): 60; Type of Charger: Battery Stack Monitor; PackageReference: G-48; ComponentLink3Description: Package Specification; PackageDescription: 48-Pin Plastic SSOP, Body 12.8 x 5.3 mm, Pitch 0.5 mm; ComponentLink3URL: http://cds.linear.com/docs/en/packaging/05081887_0_G48.pdf; ComponentLink1Description: Manufacturer URL; PackageVersion: Rev. Ã˜, 01/2011; Packing: Tape and Reel; PartNumber: LTC6804HG-1#TRPBF; Mounting Technology: Surface Mount; ComponentLink2URL: http://cds.linear.com/docs/en/datasheet/680412f.pdf; ComponentLink2Description: Datasheet; RoHS: TRUE; ComponentLink1URL: http://www.linear.com/

## Sheet BalCircuit.SchDoc
size A; SheetNumber: 2
Used 17 times, as channels U_BalCircuit1, U_BalCircuit2, U_BalCircuit3, U_BalCircuit5, U_BalCircuit6, U_BalCircuit7, U_BalCircuit8, U_BalCircuit9, U_BalCircuit10, U_BalCircuit11, U_BalCircuit12, U_BalCircuit13, U_BalCircuit14, U_BalCircuit15, U_BalCircuit16, U_BalCircuit17, U_BalCircuit4. Parts and nets are listed once, with the designators drawn on the sheet.
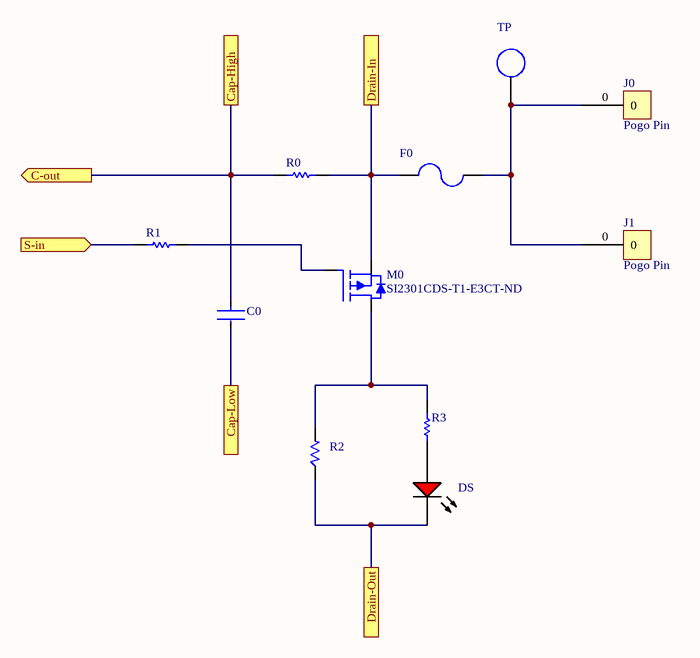
[diagram p1: BalCircuit.SchDoc]

### Parts
C0  CL21B103KCANNNC  [FP-CL21-IPC_A]  (value not drawn)
DS  19-217/R6C-AL1M2VY/3T  [EVRL-0603-2_V]  (value not drawn)
F0  3404.0112.11  [OMT125]  (value not drawn)
J0  Pogo Pin  [0852-0]
J1  Pogo Pin  [0852-0]
M0  Supplier Part Number 1: SI2301CDS-T1-E3CT-ND  [SOT23_527AG_ONS]  (hidden comment: SI2301CDS-T1-E3)
R0  RK73B2ATTD101J  [RESC2013X60X30NL20T20]  (value not drawn)
R1  RC0805JR-073K3L  [RESC0805(2012)_M]  (value not drawn)
R2  352116RFT  [FP-ERJ1TR-IPC_A]  (value not drawn)
R3  0603WAF750JT5E  [FP-AC0603-0_55-MFG]  (value not drawn)
TP  N/A  [PCB Test Point]  (value not drawn)

### Ports
C-out (out), Cap-High, Cap-Low, Drain-In, Drain-Out, S-in (in)

### Nets
C-out: C0.1 R0.1 ; port C-out, port Cap-High
Cap-Low: C0.2 ; port Cap-Low
Drain-In: F0.1 M0.2 R0.2 ; port Drain-In
Drain-Out: DS.2(K) R2.1 ; port Drain-Out
S-in: R1.1 ; port S-in
NetDS_1: DS.1(A) R3.2
NetF0_2: F0.2 J0.0 J1.0 TP.1
NetM0_1: M0.1 R1.2
NetM0_3: M0.3 R2.2 R3.1

### Channels
U_BalCircuit1: designators C0=C0_2 DS=DS0_2 F0=F0_2 J0=J0_2 J1=J1_2 M0=M0_2 R0=R0_2 R1=R1_2 R2=R2_2 R3=R3_2 TP=TP0_2; ports C-out=1-C2 Cap-High=1-C2 Cap-Low=1-C1 Drain-In=NetDS0_3_2 Drain-Out=Net0F0_1 S-in=1-S2
U_BalCircuit2: designators C0=C0_3 DS=DS0_3 F0=F0_3 J0=J0_3 J1=J1_3 M0=M0_3 R0=R0_3 R1=R1_3 R2=R2_3 R3=R3_3 TP=TP0_3; ports C-out=1-C3 Cap-High=1-C3 Cap-Low=1-C2 Drain-In=NetDS0_4_2 Drain-Out=NetDS0_3_2 S-in=1-S3
U_BalCircuit3: designators C0=C0_4 DS=DS0_4 F0=F0_4 J0=J0_4 J1=J1_4 M0=M0_4 R0=R0_4 R1=R1_4 R2=R2_4 R3=R3_4 TP=TP0_4; ports C-out=1-C4 Cap-High=1-C4 Cap-Low=1-C3 Drain-In=NetDS0_5_2 Drain-Out=NetDS0_4_2 S-in=1-S4
U_BalCircuit5: designators C0=C0_6 DS=DS0_6 F0=F0_6 J0=J0_6 J1=J1_6 M0=M0_6 R0=R0_6 R1=R1_6 R2=R2_6 R3=R3_6 TP=TP0_6; ports C-out=1-C7 Cap-High=1-C7 Cap-Low=TopMuxTerm Drain-In=NetDS0_7_2 Drain-Out=NetDS0_6_2 S-in=1-S7
U_BalCircuit6: designators C0=C0_7 DS=DS0_7 F0=F0_7 J0=J0_7 J1=J1_7 M0=M0_7 R0=R0_7 R1=R1_7 R2=R2_7 R3=R3_7 TP=TP0_7; ports C-out=1-C8 Cap-High=1-C8 Cap-Low=1-C7 Drain-In=NetDS0_8_2 Drain-Out=NetDS0_7_2 S-in=1-S8
U_BalCircuit7: designators C0=C0_8 DS=DS0_8 F0=F0_8 J0=J0_8 J1=J1_8 M0=M0_8 R0=R0_8 R1=R1_8 R2=R2_8 R3=R3_8 TP=TP0_8; ports C-out=1-C9 Cap-High=1-C9 Cap-Low=1-C8 Drain-In=NetDS0_9_2 Drain-Out=NetDS0_8_2 S-in=1-S9
U_BalCircuit8: designators C0=C0_9 DS=DS0_9 F0=F0_9 J0=J0_9 J1=J1_9 M0=M0_9 R0=R0_9 R1=R1_9 R2=R2_9 R3=R3_9 TP=TP0_9; ports C-out=1-C10 Cap-High=1-C10 Cap-Low=1-C9 Drain-In=Vmid Drain-Out=NetDS0_9_2 S-in=1-S10
U_BalCircuit9: designators C0=C0_10 DS=DS0_10 F0=F0_10 J0=J0_10 J1=J1_10 M0=M0_10 R0=R0_10 R1=R1_10 R2=R2_10 R3=R3_10 TP=TP0_10; ports C-out=2-C1 Cap-High=2-C1 Cap-Low=Vmid Drain-In=NetDS0_11_2 Drain-Out=Vmid S-in=2-S1
U_BalCircuit10: designators C0=C0_11 DS=DS0_11 F0=F0_11 J0=J0_11 J1=J1_11 M0=M0_11 R0=R0_11 R1=R1_11 R2=R2_11 R3=R3_11 TP=TP0_11; ports C-out=2-C2 Cap-High=2-C2 Cap-Low=2-C1 Drain-In=NetDS0_12_2 Drain-Out=NetDS0_11_2 S-in=2-S2
U_BalCircuit11: designators C0=C0_12 DS=DS0_12 F0=F0_12 J0=J0_12 J1=J1_12 M0=M0_12 R0=R0_12 R1=R1_12 R2=R2_12 R3=R3_12 TP=TP0_12; ports C-out=2-C3 Cap-High=2-C3 Cap-Low=2-C2 Drain-In=NetDS0_13_2 Drain-Out=NetDS0_12_2 S-in=2-S3
U_BalCircuit12: designators C0=C0_13 DS=DS0_13 F0=F0_13 J0=J0_13 J1=J1_13 M0=M0_13 R0=R0_13 R1=R1_13 R2=R2_13 R3=R3_13 TP=TP0_13; ports C-out=2-C4 Cap-High=2-C4 Cap-Low=2-C3 Drain-In=NetDS0_14_2 Drain-Out=NetDS0_13_2 S-in=2-S4
U_BalCircuit13: designators C0=C0_14 DS=DS0_14 F0=F0_14 J0=J0_14 J1=J1_14 M0=M0_14 R0=R0_14 R1=R1_14 R2=R2_14 R3=R3_14 TP=TP0_14; ports C-out=2-C5 Cap-High=2-C5 Cap-Low=2-C4 Drain-In=NetDS0_15_2 Drain-Out=NetDS0_14_2 S-in=2-S5
U_BalCircuit14: designators C0=C0_15 DS=DS0_15 F0=F0_15 J0=J0_15 J1=J1_15 M0=M0_15 R0=R0_15 R1=R1_15 R2=R2_15 R3=R3_15 TP=TP0_15; ports C-out=2-C7 Cap-High=2-C7 Cap-Low=TopMuxTerm-2 Drain-In=NetDS0_16_2 Drain-Out=NetDS0_15_2 S-in=2-S7
U_BalCircuit15: designators C0=C0_16 DS=DS0_16 F0=F0_16 J0=J0_16 J1=J1_16 M0=M0_16 R0=R0_16 R1=R1_16 R2=R2_16 R3=R3_16 TP=TP0_16; ports C-out=2-C8 Cap-High=2-C8 Cap-Low=2-C7 Drain-In=NetDS0_17_2 Drain-Out=NetDS0_16_2 S-in=2-S8
U_BalCircuit16: designators C0=C0_17 DS=DS0_17 F0=F0_17 J0=J0_17 J1=J1_17 M0=M0_17 R0=R0_17 R1=R1_17 R2=R2_17 R3=R3_17 TP=TP0_17; ports C-out=2-C9 Cap-High=2-C9 Cap-Low=2-C8 Drain-In=NetDS0_18_2 Drain-Out=NetDS0_17_2 S-in=2-S9
U_BalCircuit17: designators C0=C0_18 DS=DS0_18 F0=F0_18 J0=J0_18 J1=J1_18 M0=M0_18 R0=R0_18 R1=R1_18 R2=R2_18 R3=R3_18 TP=Vtop; ports C-out=2-C10 Cap-High=2-C10 Cap-Low=2-C9 Drain-In=Vtop Drain-Out=NetDS0_18_2 S-in=2-S10
U_BalCircuit4: designators C0=C0_5 DS=DS0_5 F0=F0_5 J0=J0_5 J1=J1_5 M0=M0_5 R0=R0_5 R1=R1_5 R2=R2_5 R3=R3_5 TP=TP0_5; ports C-out=1-C5 Cap-High=1-C5 Cap-Low=1-C4 Drain-In=NetDS0_6_2 Drain-Out=NetDS0_5_2 S-in=1-S5

### Library data of the parts
C0 = CMP-13271-003077-1: as 0C0 on sheet BMSSlaveSchematic; Voltage: 100V; Contact Plating: Tin; Height: 0.65mm; Thickness: 0.03inch; Min Operating Temperature: -55°C; Capacitance: 10nF; Length: 2mm; Max Operating Temperature: 125°C; Case Code (Imperial): 0805; Radiation Hardening: No; Dielectric: X7R; Material: Ceramic; Depth: 1.25mm; Voltage Rating: 100V; Case/Package: 0805; Tolerance: 10%; Package Quantity: 1; Width: 0.049inch; Mount: Surface Mount; Case Code (Metric): 2012; Packaging: Tape and Reel
DS = CMP-2100-03578-1: as DS0 on sheet BMSSlaveSchematic; Package Reference: 0603; Case/Package: 0603; RoHSCompliant: false; Package Description: 2-Pin Surface Mount Device, Body 1.6 x 0.8 mm; Colour: Red; Lead Free: LeadFree; Datasheet URL: https://datasheet.ciiva.com/4688/el-19-217-r6c-al1m2vy-3tpdf-187026-4688713.pdf; Manufacturer URL: http://www.everlight.com/; Datasheet Version: Rev. 1, 01/2005
F0 = OMT125: as 0F0 on sheet BMSSlaveSchematic; Supplier 1: Digi-Key; Manufacturer 1: Schurter; RoHS: Yes; Category: Fuses; Stock 1: 1439; Pricing 1: 1=0.67000, 50=0.56400, 100=0.43100, 500=0.42300, 1000=0.38171 (USD); Mount: Surface Mount,PCB; Case/Package: SMD/SMT; Number of Pins: 2; Contact Material: Copper Alloy; Contact Plating: Tin; Housing Material: Thermoplastic; Terminal Material: Tin; Min Operating Temperature: -55°C; Max Operating Temperature: 85°C; Package Quantity: 100; Voltage Rating (AC): 125V; Voltage Rating (DC): 125V; Packaging: Bag; Max Voltage Rating (DC): 125V; Max Voltage Rating (AC): 125V; Current: 1A; Termination: SMD/SMT; Fuse Current: 1A; Series: OMT 125; Length: 7.4mm; Width: 0.122inch; Height: 0.102inch; Depth: 3.1mm; Radiation Hardening: No; REACH SVHC: No SVHC; Flammability Rating: UL94 V-0; RoHS Compliant: Yes; ComponentLink1URL: https://datasheet.ciiva.com/4486/typ-omt-125-14932-4486467.pdf?src-supplier=Mouser; ComponentLink1Description: https://datasheet.ciiva.com/4486/typ-omt-125-14932-4486467.pdf?src-supplier=Mouser; ComponentLink2URL: https://datasheet.ciiva.com/26876/getdatasheetpartid-627585-26876503.pdf?src-supplier=Verical; ComponentLink2Description: https://datasheet.ciiva.com/26876/getdatasheetpartid-627585-26876503.pdf?src-supplier=Verical; ComponentLink3URL: https://datasheet.ciiva.com/17402/typ-omt-125-17402981.pdf?src-supplier=Avnet+Europe; ComponentLink3Description: https://datasheet.ciiva.com/17402/typ-omt-125-17402981.pdf?src-supplier=Avnet+Europe; ComponentLink4URL: https://datasheet.ciiva.com/1549/typ-omt-125-1549883.pdf?src-supplier=Element14; ComponentLink4Description: https://datasheet.ciiva.com/1549/typ-omt-125-1549883.pdf?src-supplier=Element14; ComponentLink5URL: https://datasheet.ciiva.com/8264/typ-omt-125-8264396.pdf?src-supplier=Avnet; ComponentLink5Description: https://datasheet.ciiva.com/8264/typ-omt-125-8264396.pdf?src-supplier=Avnet
J0 J1 = 0852-0-15-20-83-14-11-0: 90 thou stroke
M0 = SI2301CDS-T1-E3: as 0M0 on sheet BMSSlaveSchematic; Supplier 1: Digi-Key; Manufacturer Part Number 1: SI2301CDS-T1-E3; RoHS: Yes; Category: MOSFETs; Stock 1: 82098; Pricing 1: 1=0.51000, 10=0.38800, 100=0.24160, 500=0.16530, 1000=0.12716 (USD); Mount: Surface Mount; Case/Package: SOT-23-3; Number of Pins: 3; Weight: 0.050717oz; Min Operating Temperature: -55°C; Max Operating Temperature: 150°C; Package Quantity: 1; Packaging: Tape and Reel; Drain to Source Voltage (Vdss): 20V; Continuous Drain Current (ID): 3.1A; Drain to Source Resistance: 112mR; Fall Time: 35ns; Series: TrenchFET®; Length: 3.04mm; Width: 1.4mm; Height: 1.02mm; Radiation Hardening: No; REACH SVHC: Unknown; Lead Free: Lead Free; RoHS Compliant: Yes; ComponentLink1URL: https://datasheet.ciiva.com/4442/si2301cd-244544-4442236.pdf?src-supplier=Mouser; ComponentLink1Description: https://datasheet.ciiva.com/4442/si2301cd-244544-4442236.pdf?src-supplier=Mouser; ComponentLink2URL: https://datasheet.ciiva.com/22652/1719653-22652314.pdf?src-supplier=Element14; ComponentLink2Description: https://datasheet.ciiva.com/22652/1719653-22652314.pdf?src-supplier=Element14; ComponentLink3URL: https://datasheet.ciiva.com/2957/si2301cd-2957335.pdf?src-supplier=Digi-Key; ComponentLink3Description: https://datasheet.ciiva.com/2957/si2301cd-2957335.pdf?src-supplier=Digi-Key; ComponentLink4URL: https://datasheet.ciiva.com/2957/si2301cd-2957336.pdf?src-supplier=Digi-Key; ComponentLink4Description: https://datasheet.ciiva.com/2957/si2301cd-2957336.pdf?src-supplier=Digi-Key; ComponentLink5URL: https://datasheet.ciiva.com/11160/si2301cd-11160982.pdf?src-supplier=Avnet; ComponentLink5Description: https://datasheet.ciiva.com/11160/si2301cd-11160982.pdf?src-supplier=Avnet; ComponentLink6URL: https://datasheet.ciiva.com/26137/si2301cd-26137818.pdf?src-supplier=Avnet+Europe; ComponentLink6Description: https://datasheet.ciiva.com/26137/si2301cd-26137818.pdf?src-supplier=Avnet+Europe
R0 = CMP-2001-04655-1: as 0R0 on sheet BMSSlaveSchematic; Part Number: RK73B2ATTD101J
R1 = CMP-1013-00086-1: as 0R1 on sheet BMSSlaveSchematic; Tolerance: 5 %; Technology: SMT; Power: 0.125 W
R2 = 352116RFT: as 0R2 on sheet BMSSlaveSchematic; Supplier 1: Digi-Key; Manufacturer Part Number 1: 352116RFT; RoHS: Yes; Category: Chip SMD Resistors; Stock 1: 79023; Pricing 1: 1=0.83000, 10=0.61200, 100=0.35610, 1000=0.19972 (USD); Mount: Surface Mount; Case/Package: 2512; Case Code (Metric): 6432; Case Code (Imperial): 2512; Min Operating Temperature: -55°C; Max Operating Temperature: 155°C; Tolerance: 1%; Packaging: Tape and Reel; Resistor Type: Thick Film,Power resistor; Number of Terminations: 2; Power Rating: 2W; Termination: Solder; Voltage Rating (DC): 250V; Technology: THICK FILM; Series: 3521; Resistance Tolerance: 1%; Length: 6.3mm; Height: 0.55mm; Depth: 3.2mm; RoHS Compliant: Yes; REACH SVHC: No SVHC; ELV: Compliant; ComponentLink1URL: https://datasheet.ciiva.com/25610/0900766b81096b90-25610624.pdf?src-supplier=RSComponents; ComponentLink1Description: https://datasheet.ciiva.com/25610/0900766b81096b90-25610624.pdf?src-supplier=RSComponents; ComponentLink2URL: https://datasheet.ciiva.com/46391/1610601-46391497.pdf?src-supplier=Element14; ComponentLink2Description: https://datasheet.ciiva.com/46391/1610601-46391497.pdf?src-supplier=Element14; ComponentLink3URL: https://datasheet.ciiva.com/7657/1610601-7657546.pdf?src-supplier=Element14; ComponentLink3Description: https://datasheet.ciiva.com/7657/1610601-7657546.pdf?src-supplier=Element14; Supplier Part Number 1: A115989CT-ND
R3 = 0603WAF750JT5E: as 0R3 on sheet BMSSlaveSchematic; RoHS: Yes; Category: Chip SMD Resistors; Stock 1: 3; Pricing 1: 1=0.23000, 10=0.19100, 25=0.13920, 50=0.10100, 100=0.07480, 250=0.05744, 500=0.04524, 1000=0.03132 (USD); Case/Package: 0603; Case Code (Metric): 1608; Case Code (Imperial): 0603; Min Operating Temperature: -55°C; Max Operating Temperature: 155°C; Packaging: Tape and Reel; Resistor Type: Thick Film; Number of Terminations: 2; Features: Automotive AEC-Q200; Length: 0.063inch; Width: 0.032inch; Height - Seated (Max): 0.022inch; ComponentLink1URL: https://industrial.panasonic.com/sa/system/files/data/download/catalog/id_fixed-resistors_e_2.pdf?src-supplier=Digi-Key; ComponentLink1Description: https://industrial.panasonic.com/sa/system/files/data/download/catalog/id_fixed-resistors_e_2.pdf?src-supplier=Digi-Key; ComponentLink2URL: https://industrial.panasonic.com/cdbs/www-data/pdf/RDM0000/DMM0000COL5.pdf?src-supplier=Digi-Key; ComponentLink2Description: https://industrial.panasonic.com/cdbs/www-data/pdf/RDM0000/DMM0000COL5.pdf?src-supplier=Digi-Key
TP = PCB Test Point: as TP0 on sheet BMSSlaveSchematic; PartNumber: N/A; Publisher: T.Tallo; Published: 22Oct2016; Status: Active; ComponentLink1URL: http://www.mouser.com/ds/2/215/005-5009-743680.pdf; ComponentLink1Description: Datasheet

## Nets that join several sheets
Vmid: BMSSlaveSchematic (20 pins), U_BalCircuit8 (F0_9.1 M0_9.2 R0_9.2), U_BalCircuit9 (C0_10.2 DS0_10.2 R2_10.1)
1-C1: BMSSlaveSchematic (0C0.1 0R0.1 U1.24), U_BalCircuit1 (C0_2.2)
1-C2: BMSSlaveSchematic (U1.22), U_BalCircuit1 (C0_2.1 R0_2.1), U_BalCircuit2 (C0_3.2)
1-C3: BMSSlaveSchematic (U1.20), U_BalCircuit2 (C0_3.1 R0_3.1), U_BalCircuit3 (C0_4.2)
1-C4: BMSSlaveSchematic (U1.18), U_BalCircuit3 (C0_4.1 R0_4.1), U_BalCircuit4 (C0_5.2)
1-C5: BMSSlaveSchematic (U1.16), U_BalCircuit4 (C0_5.1 R0_5.1)
1-C7: BMSSlaveSchematic (U1.12), U_BalCircuit5 (C0_6.1 R0_6.1), U_BalCircuit6 (C0_7.2)
1-C8: BMSSlaveSchematic (U1.10), U_BalCircuit6 (C0_7.1 R0_7.1), U_BalCircuit7 (C0_8.2)
1-C9: BMSSlaveSchematic (U1.8), U_BalCircuit7 (C0_8.1 R0_8.1), U_BalCircuit8 (C0_9.2)
1-C10: BMSSlaveSchematic (U1.6), U_BalCircuit8 (C0_9.1 R0_9.1)
1-S2: BMSSlaveSchematic (U1.23), U_BalCircuit1 (R1_2.1)
1-S3: BMSSlaveSchematic (U1.21), U_BalCircuit2 (R1_3.1)
1-S4: BMSSlaveSchematic (U1.19), U_BalCircuit3 (R1_4.1)
1-S5: BMSSlaveSchematic (U1.17), U_BalCircuit4 (R1_5.1)
1-S7: BMSSlaveSchematic (U1.13), U_BalCircuit5 (R1_6.1)
1-S8: BMSSlaveSchematic (U1.11), U_BalCircuit6 (R1_7.1)
1-S9: BMSSlaveSchematic (U1.9), U_BalCircuit7 (R1_8.1)
1-S10: BMSSlaveSchematic (U1.7), U_BalCircuit8 (R1_9.1)
2-C1: BMSSlaveSchematic (U2.24), U_BalCircuit9 (C0_10.1 R0_10.1), U_BalCircuit10 (C0_11.2)
2-C2: BMSSlaveSchematic (U2.22), U_BalCircuit10 (C0_11.1 R0_11.1), U_BalCircuit11 (C0_12.2)
2-C3: BMSSlaveSchematic (U2.20), U_BalCircuit11 (C0_12.1 R0_12.1), U_BalCircuit12 (C0_13.2)
2-C4: BMSSlaveSchematic (U2.18), U_BalCircuit12 (C0_13.1 R0_13.1), U_BalCircuit13 (C0_14.2)
2-C5: BMSSlaveSchematic (U2.16), U_BalCircuit13 (C0_14.1 R0_14.1)
2-C7: BMSSlaveSchematic (U2.12), U_BalCircuit14 (C0_15.1 R0_15.1), U_BalCircuit15 (C0_16.2)
2-C8: BMSSlaveSchematic (U2.10), U_BalCircuit15 (C0_16.1 R0_16.1), U_BalCircuit16 (C0_17.2)
2-C9: BMSSlaveSchematic (U2.8), U_BalCircuit16 (C0_17.1 R0_17.1), U_BalCircuit17 (C0_18.2)
2-C10: BMSSlaveSchematic (U2.6), U_BalCircuit17 (C0_18.1 R0_18.1)
2-S1: BMSSlaveSchematic (U2.25), U_BalCircuit9 (R1_10.1)
2-S2: BMSSlaveSchematic (U2.23), U_BalCircuit10 (R1_11.1)
2-S3: BMSSlaveSchematic (U2.21), U_BalCircuit11 (R1_12.1)
2-S4: BMSSlaveSchematic (U2.19), U_BalCircuit12 (R1_13.1)
2-S5: BMSSlaveSchematic (U2.17), U_BalCircuit13 (R1_14.1)
2-S7: BMSSlaveSchematic (U2.13), U_BalCircuit14 (R1_15.1)
2-S8: BMSSlaveSchematic (U2.11), U_BalCircuit15 (R1_16.1)
2-S9: BMSSlaveSchematic (U2.9), U_BalCircuit16 (R1_17.1)
2-S10: BMSSlaveSchematic (U2.7), U_BalCircuit17 (R1_18.1)
Net0F0_1: BMSSlaveSchematic (0F0.1 0M0.2 0R0.2), U_BalCircuit1 (DS0_2.2 R2_2.1)
NetDS0_3_2: U_BalCircuit1 (F0_2.1 M0_2.2 R0_2.2), U_BalCircuit2 (DS0_3.2 R2_3.1)
NetDS0_4_2: U_BalCircuit2 (F0_3.1 M0_3.2 R0_3.2), U_BalCircuit3 (DS0_4.2 R2_4.1)
NetDS0_5_2: U_BalCircuit3 (F0_4.1 M0_4.2 R0_4.2), U_BalCircuit4 (DS0_5.2 R2_5.1)
NetDS0_6_2: BMSSlaveSchematic (R13.2), U_BalCircuit5 (DS0_6.2 R2_6.1), U_BalCircuit4 (F0_5.1 M0_5.2 R0_5.2)
NetDS0_7_2: U_BalCircuit5 (F0_6.1 M0_6.2 R0_6.2), U_BalCircuit6 (DS0_7.2 R2_7.1)
NetDS0_8_2: U_BalCircuit6 (F0_7.1 M0_7.2 R0_7.2), U_BalCircuit7 (DS0_8.2 R2_8.1)
NetDS0_9_2: U_BalCircuit7 (F0_8.1 M0_8.2 R0_8.2), U_BalCircuit8 (DS0_9.2 R2_9.1)
NetDS0_11_2: U_BalCircuit9 (F0_10.1 M0_10.2 R0_10.2), U_BalCircuit10 (DS0_11.2 R2_11.1)
NetDS0_12_2: U_BalCircuit10 (F0_11.1 M0_11.2 R0_11.2), U_BalCircuit11 (DS0_12.2 R2_12.1)
NetDS0_13_2: U_BalCircuit11 (F0_12.1 M0_12.2 R0_12.2), U_BalCircuit12 (DS0_13.2 R2_13.1)
NetDS0_14_2: U_BalCircuit12 (F0_13.1 M0_13.2 R0_13.2), U_BalCircuit13 (DS0_14.2 R2_14.1)
NetDS0_15_2: BMSSlaveSchematic (R27.2), U_BalCircuit13 (F0_14.1 M0_14.2 R0_14.2), U_BalCircuit14 (DS0_15.2 R2_15.1)
NetDS0_16_2: U_BalCircuit14 (F0_15.1 M0_15.2 R0_15.2), U_BalCircuit15 (DS0_16.2 R2_16.1)
NetDS0_17_2: U_BalCircuit15 (F0_16.1 M0_16.2 R0_16.2), U_BalCircuit16 (DS0_17.2 R2_17.1)
NetDS0_18_2: U_BalCircuit16 (F0_17.1 M0_17.2 R0_17.2), U_BalCircuit17 (DS0_18.2 R2_18.1)
TopMuxTerm: BMSSlaveSchematic (R13.1 U1.14), U_BalCircuit5 (C0_6.2)
TopMuxTerm-2: BMSSlaveSchematic (R27.1 U2.14), U_BalCircuit14 (C0_15.2)
Vtop: BMSSlaveSchematic (R20.2 R25.2 R26.2), U_BalCircuit17 (F0_18.1 M0_18.2 R0_18.2)